# Altium schematic sheet OUTPUT_CONNECTORS.SchDoc
size A4; SheetNumber: 5; SheetTotal: 7
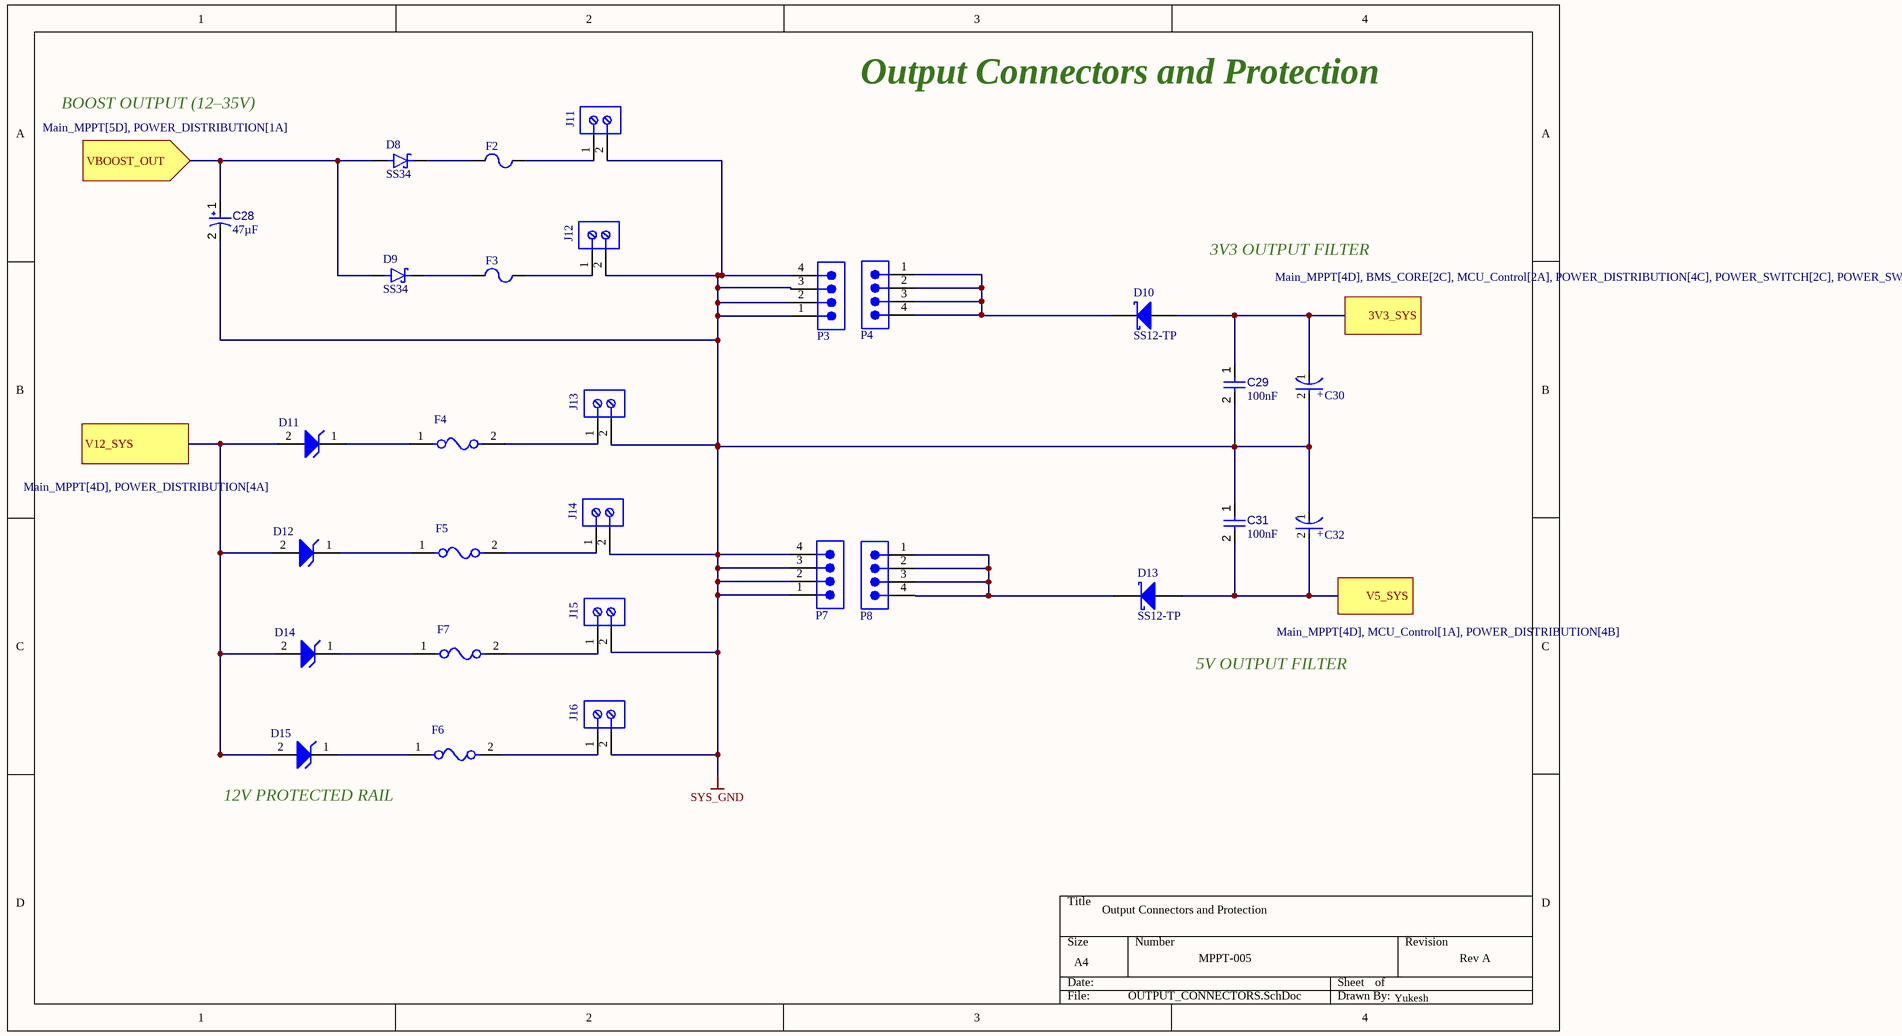
[diagram p0: OUTPUT_CONNECTORS.SchDoc]

## Parts
C28  value 47µF  [CAPPR55-250-1120X630X1220]  (hidden comment: ECA1HM470)
C29  value 100nF  [CAPC0402(1005)60_L]  (hidden comment: Capacitor 100nF +/-20% 25V 0402)
C30  F980J106MMA  [FP-F98M-MFG]  (value not drawn)
C31  value 100nF  [CAPC0402(1005)60_L]  (hidden comment: Capacitor 100nF +/-20% 25V 0402)
C32  F980J106MMA  [FP-F98M-MFG]  (value not drawn)
D8  SS34  [Copy of DIOM7959X265N]
D9  SS34  [Copy of DIOM7959X265N]
D10  SS12-TP  [MCC-DO-214AC-2_V]
D11  824500600  [WE-TVSP_DO-214AC_Unidirectional]  (value not drawn)
D12  824500600  [WE-TVSP_DO-214AC_Unidirectional]  (value not drawn)
D13  SS12-TP  [MCC-DO-214AC-2_V]
D14  824500600  [WE-TVSP_DO-214AC_Unidirectional]  (value not drawn)
D15  824500600  [WE-TVSP_DO-214AC_Unidirectional]  (value not drawn)
F2  0154001.DR  [LFUS-0154001.DR_V]  (value not drawn)
F3  0154001.DR  [LFUS-0154001.DR_V]  (value not drawn)
F4  02810005H  [FP-02810005H-MFG]  (value not drawn)
F5  02810005H  [FP-02810005H-MFG]  (value not drawn)
F6  02810005H  [FP-02810005H-MFG]  (value not drawn)
F7  02810005H  [FP-02810005H-MFG]  (value not drawn)
J11  1714955  [PHOE-1714955_V]  (value not drawn)
J12  1714955  [PHOE-1714955_V]  (value not drawn)
J13  1714955  [PHOE-1714955_V]  (value not drawn)
J14  1714955  [PHOE-1714955_V]  (value not drawn)
J15  1714955  [PHOE-1714955_V]  (value not drawn)
J16  1714955  [PHOE-1714955_V]  (value not drawn)
P3  TSW-104-08-G-S  [SMTC-TSW-104-08-X-S]  (value not drawn)
P4  TSW-104-08-G-S  [SMTC-TSW-104-08-X-S]  (value not drawn)
P7  TSW-104-08-G-S  [SMTC-TSW-104-08-X-S]  (value not drawn)
P8  TSW-104-08-G-S  [SMTC-TSW-104-08-X-S]  (value not drawn)

## Ports
3V3_SYS (see Main_MPPT[4D], BMS_CORE[2C], MCU_Control[2A], POWER_DISTRIBUTION[4C], POWER_SWITCH[2C], POWER_SWITCH[2D], USB_DEBUG[4B]), V5_SYS (see Main_MPPT[4D], MCU_Control[1A], POWER_DISTRIBUTION[4B]), V12_SYS (see Main_MPPT[4D], POWER_DISTRIBUTION[4A]), VBOOST_OUT (in, see Main_MPPT[5D], POWER_DISTRIBUTION[1A])

## Nets
SYS_GND: C28.2 C29.2 C30.2(A) C31.1 C32.1(C) J11.2 J12.2 J13.2 J14.2 J15.2 J16.2 P3.1 P3.2 P3.3 P3.4 P7.1 P7.2 P7.3 P7.4
3V3_SYS: C29.1 C30.1(C) D10.1(A) ; port 3V3_SYS
V5_SYS: C31.2 C32.2(A) D13.1(A) ; port V5_SYS
V12_SYS: D11.2(A) D12.2(A) D14.2(A) D15.2(A) ; port V12_SYS
VBOOST_OUT: C28.1 D8.A D9.A ; port VBOOST_OUT
NetD8_C: D8.C(K) F2.1
NetD9_C: D9.C(K) F3.1
NetD10_2: D10.2(K) P4.1 P4.2 P4.3 P4.4
NetD11_1: D11.1(K) F4.1
NetD12_1: D12.1(K) F5.1
NetD13_2: D13.2(K) P8.1 P8.2 P8.3 P8.4
NetD14_1: D14.1(K) F7.1
NetD15_1: D15.1(K) F6.1
NetF2_2: F2.2 J11.1
NetF3_2: F3.2 J12.1
NetF4_2: F4.2 J13.1
NetF5_2: F5.2 J14.1
NetF6_2: F6.2 J16.1
NetF7_2: F7.2 J15.1

## Notes on the sheet
- BOOST OUTPUT (12–35V)
- Output Connectors and Protection
- 3V3 OUTPUT FILTER
- 5V OUTPUT FILTER
- (near D15) 12V PROTECTED RAIL
- MPPT-005
- Rev A
- Yukesh
- (in symbol CMP-12464-000001-1) +

## Library data of the parts
C28 = CMP-001-00030-7: Aluminum Electrolytic Capacitor, 47 uF, +/- 20%, 50 V, -40 to 85 degC, 2-Pin THD, RoHS, Bulk; Manufacturer: Panasonic; Voltage Rating: 50V; Ripple Current: 130mA; Package Reference: CAPPR55-250-1120X630X1220; Packaging: Bulk; Case/Package: Radial; Pins: 2; Package Description: 2-Pin Radial Lead, Dia 6.3 mm, Height 12.2 mm; Capacitor Type: Electrolytic; Max Operating Temperature: 85°C; Min Operating Temperature: -40°C; Datasheet Version: Rev. 05, 10/2016; Manufacturer URL: http://www.panasonic.com/; RoHS Compliant: True; Lead Pitch: 2.5mm; Package Quantity: 200; Mounting Technology: TH; Ripple Current (AC): 130mA; Datasheet URL: https://industrial.panasonic.com/cdbs/www-data/pdf/RDF0000/ABA0000C1218.pdf; Tolerance: 20%; Diameter: 6.3mm
C29 C31 = CMP-001-00065-4: Chip Capacitor, 100nF +/-20%, 25V, 0402, Thickness 0.6 mm; Tolerance: 10%; Max Operating Temperature: 85°C; Min Operating Temperature: -55°C; Pins: 2; Voltage Rating: 25V; Mounting Technology: SMT; Case/Package: 0402
C30 C32 = CMP-12464-000001-1: CAP TANT 10UF 20% 6.3V 0603; Manufacturer: Nichicon; Temperature Coefficient: 30%; Ripple Current: 65mA; Esr: 6Ω; Material: Tantalum; Leakage Current: 0.6uA; Dissipation Factor: 8%; Life: 1000Hours; Package: F98M; Digikey Description: CAP TANT 10UF 20% 6.3V 0603; ComponentLink2Description: Datasheet; Voltage Rating: 6.3V; Octopart: https://octopart.com/f980j106mma-nichicon-220777; Automotive: No; Capacitance: 10uF; Temperature: -55°C to +125°C; Lead Free: Yes; RoHS: TRUE; Manufacturer Part Number: F980J106MMA; Mouser Description: Cap Tant Solid 10uF 6.3V M CASE 20% (1.6 X 0.85 X 0.8mm) Inward L SMD 6 Ohm 125C Automotive T/R; Category: Cap; Footprint Url: https://www.avx.com/download/software/literature/AVX-Footprint-Library.pdf; Tolerance: 20%; Temperature Range High: +125°C; Device Class L3: Tantalum Capacitors; ComponentLink2URL: http://datasheets.avx.com/F98.pdf; Device Class L2: Capacitors; Temperature Range Low: -55°C; Value: 10uF; Device Class L1: Passive Components; Height: 0.9mm
D8 D9 = CMP-004-00071-2: Diode Schottky 40 V 3A Surface Mount SMC (DO-214AB); Value: IC; MF: onsemi; Source: SS34.SchLib; SnapEDA_Link: https://www.snapeda.com/parts/SS34/Onsemi/view-part/?ref=snap; Case/Package: SMC-2 ON Semiconductor; Component Type: Standard; MP: SS34; Pins: 2; Design Item ID: SS34; Check_prices: https://www.snapeda.com/parts/SS34/Onsemi/view-part/?ref=eda
D10 D13 = CMP-004-00018-2: Schottky Rectifier, 20 V, 1 A, -55 to 125 degC, 2-Pin DO-214AC, RoHS, Tape and Reel; Manufacturer: Micro Commercial Components; Forward Voltage: 450mV; Max Surge Current: 30A; Forward Current: 1A; Peak Reverse Current: 500uA; Package Quantity: 1; Packaging: CutTape; Datasheet Version: Rev. B, 11/2011; Manufacturer URL: http://www.mccsemi.com/; Max Operating Temperature: 125°C; Pins: 2; Min Operating Temperature: -55°C; Package Reference: DO-214AC-2; Case/Package: SMA; Package Description: 2-Pin Molded Diode, Body 4.315 x 2.705 mm; Mounting Technology: SM; Datasheet URL: http://www.mccsemi.com/up_pdf/SS12-SS110(HSMA).PDF; RoHS Compliant: True
D11 D12 D14 D15 = CMP-03913-71101530-2: TVS diode [Würth Elektronik] 824500600 TVS diode; Peak Pulse Current: 38.8A; Clamping Voltage: 10.3V; Min Breakdown Voltage: 7.02V; Peak Pulse Power: 400W; Number of Unidirectional Channels: 1; Power Line Protection: No; Reverse Standoff Voltage: 6V; Leakage Current: 800µA; Polarity: Unidirectional; Mount: Surface Mount; Packaging: Cut Tape; Breakdown Voltage: 7.02V; RoHS: Compliant; Length: 4.24mm; Height: 2.25mm; Number of Pins: 2; Max Operating Temperature: 150°C; REACH SVHC: Unknown; Width: 2.67mm; Max Breakdown Voltage: 7.02V; Composition: Zener; Min Operating Temperature: -65°C
F2 F3 = CMP-2000-05587-1: Very Fast-Acting Fuse, 1 A, -55 to 125 degC, 2-Pin SMD, RoHS, Tape and Reel; Manufacturer: Littelfuse; Body Material: Ceramic,Thermoplastic; Current Rating: 1A; Case Height: 3.81mm; Voltage Rating DC: 60V; Type: Omni-BlokSMD/SMTFuseandHolderAssembly; Voltage Rating: 125V; Case Width: 5.03mm; Voltage Rating AC: 72V; Fuse Size / Group: OMNI-BLOK; Fuse Type: FastBlow; Case Length: 9.73mm; Packaging: Reel; Mounting Technology: SurfaceMount; RoHS: Details; Product Type: SurfaceMountFusewithFuseHolder; Package Description: 2-Pin Surface Mount Device, Body 9.73 x 5.03 mm; Brand: Littelfuse; Series: 154; Package Reference: 154001; Dimensions: 9.73mmLx5.03mmW; Mounting Style: SMD/SMT; Datasheet URL: http://www.littelfuse.com/~/media/electronics/datasheets/fuses/littelfuse_fuse_154_154t_154l_154tl_datasheet.pdf.pdf; Manufacturer URL: http://www.littelfuse.com/; Product Category: SurfaceMountFuses; Datasheet Version: 04/2016; Product: SurfaceMountFuses; Factory Pack Quantity: 1500; Termination Style: SMD/SMT; Operating Temperature Range: -55Cto+125C
F4-F7 = CMP-08604-000019-1: FUSE HLDR RADIAL 125V 5A PNL MNT; Manufacturer: Littelfuse; Conn Orientation: Vertical; Number Of Fuses: 1; Standoff Height: 0.032inch; Mouser Description: Fuse Holder Micro Vertical PCB Mount; Digikey Description: FUSE HLDR RADIAL 125V 5A PNL MNT; Octopart: https://octopart.com/02810005h-littelfuse-557282; Ambient Temperature Range Low: -40°C; Device Class L3: unset; Fuse Current: 5A; Lead Free: Yes; Height: 0.262inch; Manufacturer Part Number: 02810005H; Voltage Rating Ac: 125V; Device Class L1: Circuit Protection; Automotive: No; Voltage Rating Dc: 125V; ComponentLink2Description: Datasheet; Category: Fuse; ComponentLink2URL: https://www.littelfuse.com/~/media/electronics/datasheets/fuse_holders/littelfuse_fuse_holder_281_556_557_datasheet.pdf.pdf; Ambient Temperature Range High: +100°C; RoHS: TRUE; Device Class L2: Fuse Holders; Package: 02810005H
J11-J16 = CMP-2000-05797-1: PC Terminal Block, Pitch 6.35 mm, 1 x 2 Position, Height 21.5 mm, Tail Lenght 5.1 mm, RoHS, Bulk; Manufacturer: Phoenix Contact; Package Description: PC Terminal Block, Pitch 6.35 mm, 1 x 2 Position, Height 21.5 mm, Tail Lenght 5.1 mm; Datasheet URL: http://media.digikey.com/pdf/Data%20Sheets/Phoenix%20Contact%20PDFs/1714955.pdf; Package Reference: 1714955; Manufacturer URL: http://www.phoenixcontact.com/; Datasheet Version: 02/2010; Mounting Technology: ThroughHole
P3 P4 P7 P8 = CMP-1024-00357-1: 0.025" SQ Post Header, Through-hole, Vertical, -55 to 125 degC, 2.54 mm Pitch, 4-Pin, Male, RoHS; Manufacturer: Samtec; Pitch: 2.54 mm; RoHS: True; ComponentLink3URL: http://www.samtec.com/documents/webfiles/cpdf/TSW-XXX-XX-XXX-X-XX-XXX-MKT.pdf; Mounting Technology: Through-hole; ComponentLink2URL: http://www.samtec.com/documents/webfiles/pdf/TSW_TH.PDF; ComponentLink1URL: http://www.samtec.com; ComponentLink3Description: Package Specification; PackageVersion: DM, 8/1988; ComponentLink2Description: Datasheet; PackageReference: TSW-104-08-X-S; PackageDescription: .025[0.64] SQ. Post Terminal Strip Assembly; PartNumber: TSW-104-08-G-S; ComponentLink1Description: Manufacturer URL; Temperature Range: -55 to 125 degC; DatasheetVersion: F-214; Orientation: Vertical